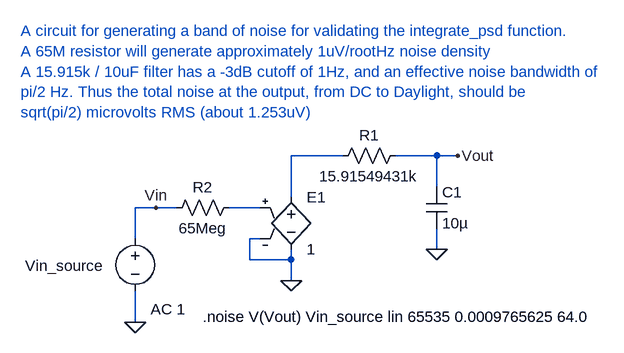
[diagram p0: schematic validate_integrate_psd.asc]
validate_integrate_psd.asc, the LTspice schematic file:
Version 4
SHEET 1 2236 752
WIRE 304 -240 224 -240
WIRE 448 -240 384 -240
WIRE 480 -240 448 -240
WIRE 448 -192 448 -240
WIRE 224 -176 224 -240
WIRE 16 -160 -16 -160
WIRE 48 -160 16 -160
WIRE 176 -160 128 -160
WIRE -16 -112 -16 -160
WIRE 176 -112 160 -112
WIRE 448 -96 448 -128
WIRE 160 -80 160 -112
WIRE 224 -80 224 -96
WIRE 224 -80 160 -80
WIRE 224 -48 224 -80
WIRE -16 16 -16 -32
FLAG -16 16 0
FLAG 16 -160 Vin
FLAG 480 -240 Vout
FLAG 448 -96 0
FLAG 224 -48 0
SYMBOL voltage -16 -128 R0
WINDOW 123 24 124 Left 2
WINDOW 39 0 0 Left 2
WINDOW 0 -169 57 Left 2
SYMATTR Value2 AC 1
SYMATTR InstName Vin_source
SYMATTR Value ""
SYMBOL res 400 -256 R90
WINDOW 0 0 56 VBottom 2
WINDOW 3 32 56 VTop 2
SYMATTR InstName R1
SYMATTR Value 15.91549431k
SYMBOL cap 432 -192 R0
SYMATTR InstName C1
SYMATTR Value 10µ
SYMBOL res 144 -176 R90
WINDOW 0 0 56 VBottom 2
WINDOW 3 32 56 VTop 2
SYMATTR InstName R2
SYMATTR Value 65Meg
SYMBOL e 224 -192 R0
SYMATTR InstName E1
SYMATTR Value 1
TEXT 88 8 Left 2 !.noise V(Vout) Vin_source lin 65535 0.0009765625 64.0
TEXT -192 -432 Left 2 ;A circuit for generating a band of noise for validating the integrate_psd function.\nA 65M resistor will generate approximately 1uV/rootHz noise density\nA 15.915k / 10uF filter has a -3dB cutoff of 1Hz, and an effective noise bandwidth of\npi/2 Hz. Thus the total noise at the output, from DC to Daylight, should be\nsqrt(pi/2) microvolts RMS (about 1.253uV)

The netlist it stands for:
* validate_integrate_psd.asc
Vin_source Vin 0 AC 1
R1 Vout N001 15.91549431k
C1 Vout 0 10µ
R2 N002 Vin 65Meg
E1 N001 0 N002 0 1
.noise V(Vout) Vin_source lin 65535 0.0009765625 64.0
* A circuit for generating a band of noise for validating the integrate_psd function.
* A 65M resistor will generate approximately 1uV/rootHz noise density
* A 15.915k / 10uF filter has a -3dB cutoff of 1Hz, and an effective noise bandwidth of
* pi/2 Hz. Thus the total noise at the output, from DC to Daylight, should be
* sqrt(pi/2) microvolts RMS (about 1.253uV)
.backanno
.end